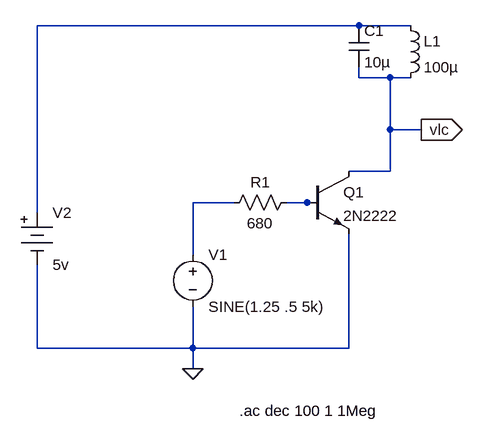
[diagram p0: schematic TANk.asc]
TANk.asc, the LTspice schematic file:
Version 4
SHEET 1 1072 752
WIRE 640 144 144 144
WIRE 720 144 640 144
WIRE 640 224 640 208
WIRE 688 224 640 224
WIRE 720 224 688 224
WIRE 688 304 688 224
WIRE 736 304 688 304
WIRE 688 368 688 304
WIRE 688 368 624 368
WIRE 448 416 384 416
WIRE 560 416 528 416
WIRE 576 416 560 416
WIRE 144 432 144 144
WIRE 384 496 384 416
WIRE 144 640 144 512
WIRE 384 640 384 576
WIRE 384 640 144 640
WIRE 624 640 624 464
WIRE 624 640 384 640
WIRE 384 672 384 640
FLAG 384 672 0
FLAG 736 304 vlc
IOPIN 736 304 Out
SYMBOL voltage 384 480 R0
SYMATTR InstName V1
SYMATTR Value SINE(1.25 .5 5k)
SYMATTR Value2 AC .5
SYMATTR SpiceLine Rser=0
SYMBOL res 544 400 R90
WINDOW 0 0 56 VBottom 2
WINDOW 3 32 56 VTop 2
SYMATTR InstName R1
SYMATTR Value 680
SYMBOL Misc/battery 144 416 R0
SYMATTR InstName V2
SYMATTR Value 5v
SYMBOL npn 560 368 R0
SYMATTR InstName Q1
SYMATTR Value 2N2222
SYMBOL ind 704 128 R0
SYMATTR InstName L1
SYMATTR Value 100µ
SYMBOL cap 624 144 R0
SYMATTR InstName C1
SYMATTR Value 10µ
TEXT 456 736 Left 2 !.ac dec 100 1 1Meg

The netlist it stands for:
* TANk.asc
V1 N002 0 SINE(1.25 .5 5k) AC .5 Rser=0
R1 N003 N002 680
V2 N001 0 5v
Q1 vlc N003 0 0 2N2222
L1 N001 vlc 100µ
C1 N001 vlc 10µ
.model NPN NPN
.model PNP PNP
.lib standard.bjt
.ac dec 100 1 1Meg
.backanno
.end